# EAGLE design macse (EAGLE 9.6.1)
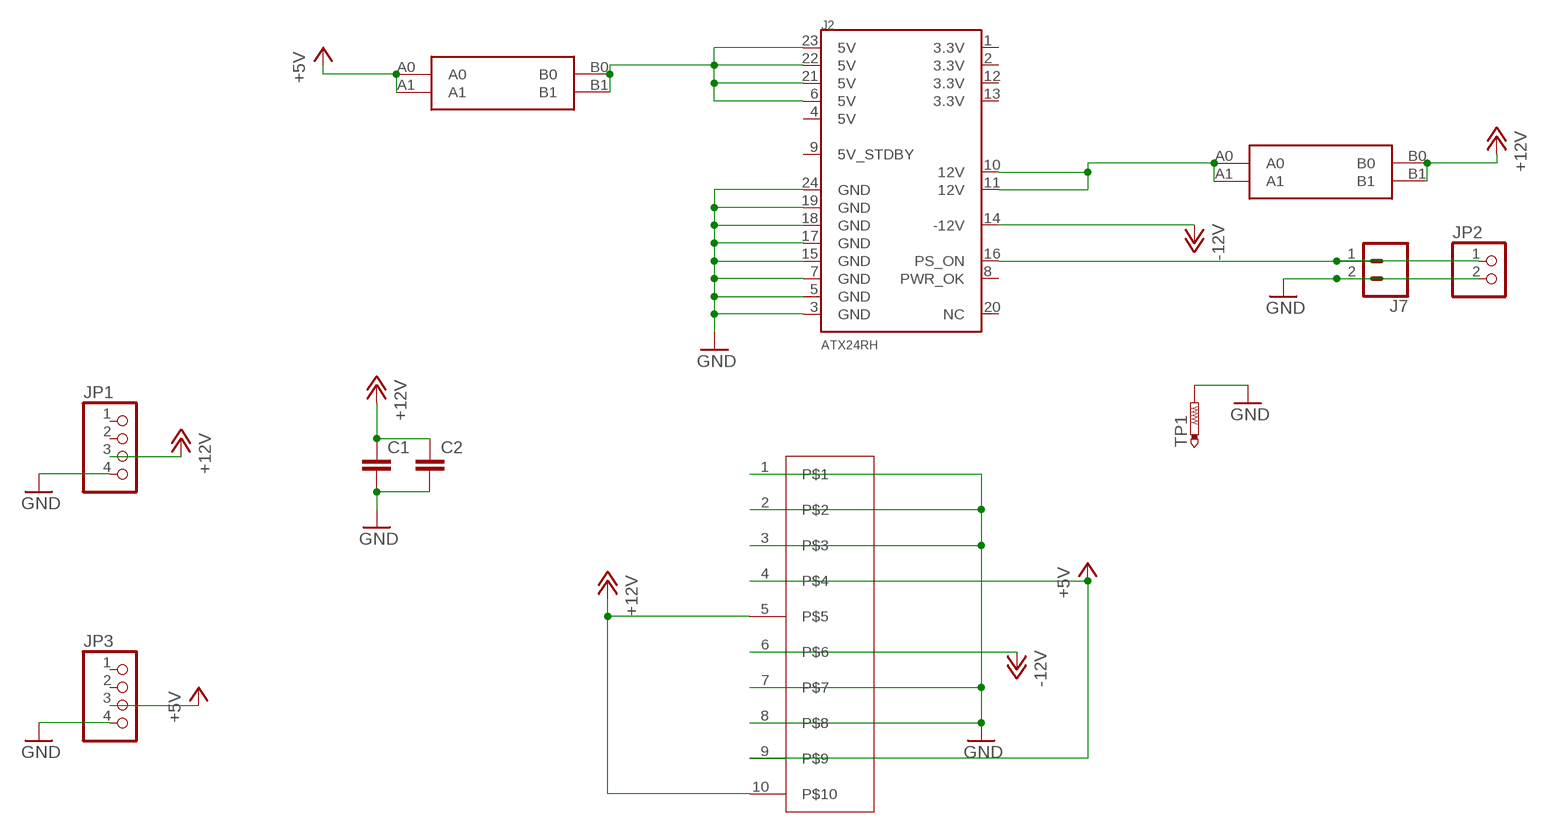
[diagram p0: schematic, sheet 1]

## Parts
C1  C5/2.5  [C5B2.5]
C2  C5/2.5  [C5B2.5]
J2  ATX24RH  [ATX24_RIGHT_ANGLE]
J7  CONN_023.5MM-NO_SILK  [SCREWTERMINAL-3.5MM-2-NS]
JP1  PINHD-1X4  [1X04]
JP2  PINHD-1X2  [1X02]
JP3  PINHD-1X4  [1X04]
TP1  PTR1PAD1-20Y  [P1-20Y]
U$1  MACSE  [MACSE_10P_STRAIGHT]
U$2  CAR_FUSE_HOLDER3IN1  [FUSE_HOLDER_3IN1]
U$8  CAR_FUSE_HOLDER3IN1  [FUSE_HOLDER_3IN1]

## Nets
+5V: JP3.3 U$1.4 U$1.9 U$8.A0 U$8.A1
+12V: C1.1 C2.1 JP1.3 U$1.5 U$1.10 U$2.B0 U$2.B1
-12V: J2.14(-12V) U$1.6
GND: C1.2 C2.2 J2.3(GND) J2.5(GND) J2.7(GND) J2.15(GND) J2.17(GND) J2.18(GND) J2.19(GND) J2.24(GND) J7.2 JP1.4 JP2.2 JP3.4 TP1.TP U$1.1 U$1.2 U$1.3 U$1.7 U$1.8
N$5: J2.16(PS_ON) J7.1 JP2.1
N$6: J2.6(5V) J2.21(5V) J2.22(5V) J2.23(5V) U$8.B0 U$8.B1
N$8: J2.10(12V) J2.11(12V) U$2.A0 U$2.A1
Unconnected: J2.1(3.3V) J2.2(3.3V) J2.4(5V) J2.8(PWR_OK) J2.9(5V_STDBY) J2.12(3.3V) J2.13(3.3V) J2.20(NC) JP1.1 JP1.2 JP3.1 JP3.2

## Library data of the parts
C1 C2 = capacitor-wima:C: CAPACITOR naming: grid - package width
J2 = macse:ATX24: ATX24 Pin Power Supply Connector This is a good connector for connecting a computer power supply to a PCB. It's massive, but provides many amps of power at 5V and 12V. SKU: PRT-09498
J7 = atx_power_control:CONN_02: Multi connection point. Often used as Generic Header-pin footprint for 0.1 inch spaced/style header connections On any of the 0.1 inch spaced packages, you can populate with these: Break Away Headers - Straight <https://www.sparkfun.com/products/116> (PRT-00116) Break Away Male Headers - Right Angle <https://www.sparkfun.com/products/553> (PRT-00553) Female Headers <https://www.sparkfun.com/products/115> (PRT-00115) Break Away Headers - Machine Pin <https://www.sparkfun.com/products/117> (PRT-00117) Break Away Female Headers - Swiss Machine Pin <https://www.sparkfun.com/products/743> (PRT-00743) For SCREWTERMINALS and SPRING TERMINALS visit here: Screw Terimnals on SparkFun.com <https://www.sparkfun.com/search/results?term=Screw+Terminals> (5mm/3.5mm/2.54mm spacing) This device is also useful as a general connection point to wire up your design to another part of your project. Our various solder wires solder well into these plated through hole pads. Hook-Up Wire - Assortment (Stranded, 22 AWG) <https://www.sparkfun.com/products/11375> (PRT-11375) Hook-Up Wire - Assortment (Solid Core, 22 AWG) <https://www.sparkfun.com/products/11367> (PRT-11367) View the entire wire category on our website here <https://www.sparkfun.com/categories/141> Special notes: Molex polarized connector foot print use with: PRT-08233 with associated crimp pins and housings. 2.54_SCREWTERM for use with PRT-10571. 3.5mm Screw Terminal footprints for PRT-08084 5mm Screw Terminal footprints for use with PRT-08432; PROD_ID: CONN-13512; SF_ID: PRT-09918; SF_SKU: PRT-08432; SKU: PRT-09914
JP1 JP3 = atx_power_control:PINHD-1X4: PIN HEADER
JP2 = pinhead:PINHD-1X2: PIN HEADER
TP1 = testpad:PTR1: TEST PIN
U$1 = atx4vc:MACSE
U$2 U$8 = atx_power_control:CAR_FUSE_HOLDER

## Board
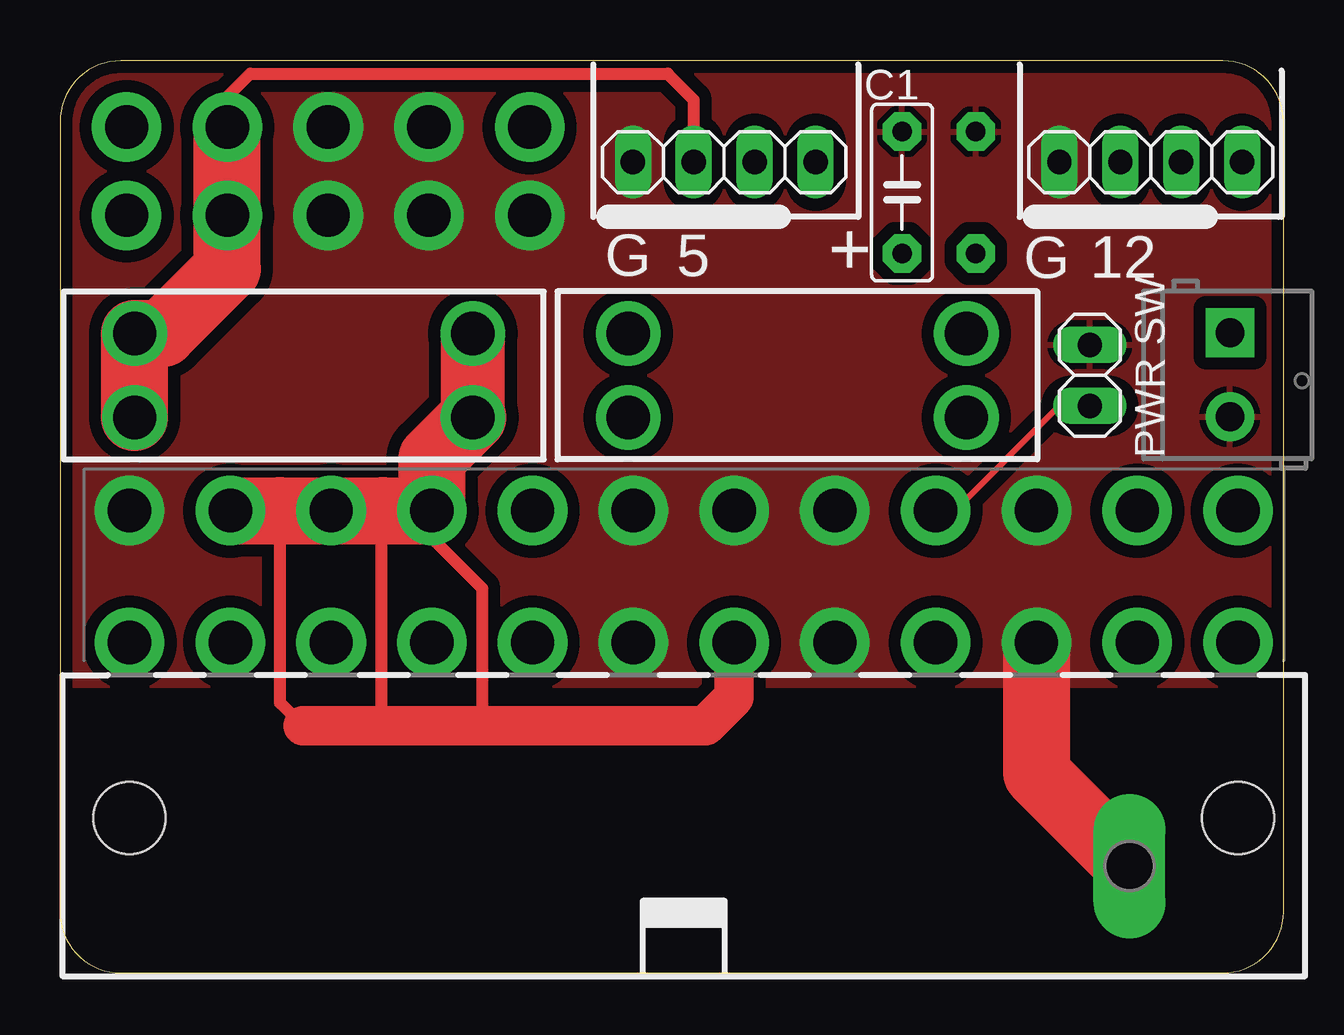
[diagram p1: board, top side]
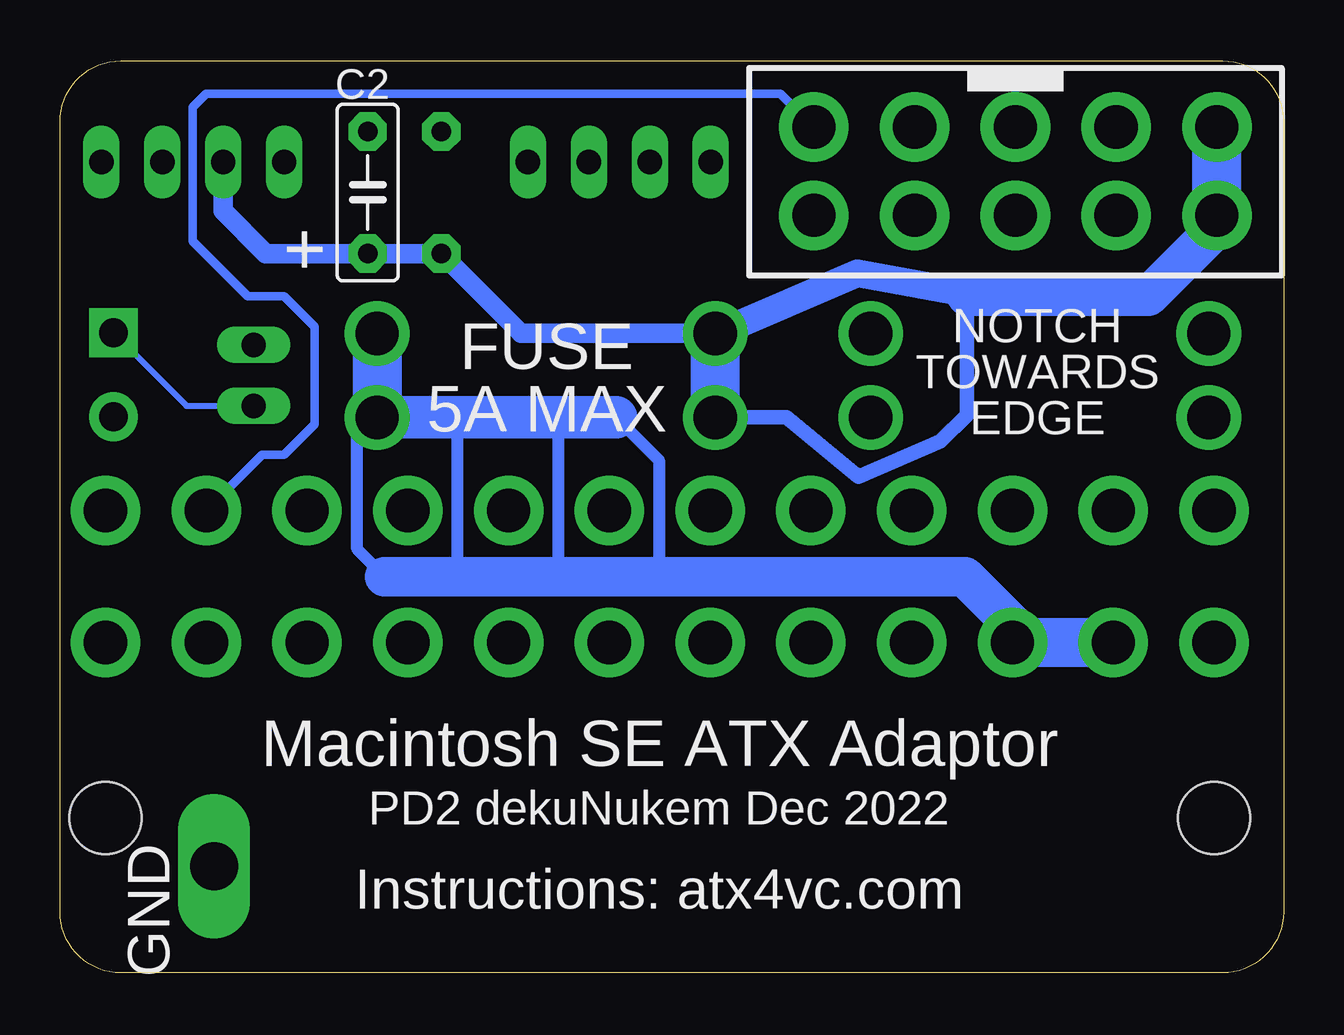
[diagram p2: board, bottom side, seen from below]

Size 51 x 38 mm. Coordinates in mm from the lower left corner, seen from the top.
Outline: 0,35.46 0,2.54 arc90 2.54,0 48.46,0 arc90 51,2.54 51,35.46 arc90 48.46,38 2.54,38 arc90 0,35.46
Copper layers (1*16): Top 0.035mm / dielectric 1.5mm / Bottom 0.035mm
Design rules "deku_2layer_6mil *": minimum track width 6mil, minimum drill 15mil, track to track 20mil, track to pad 6mil, pad to pad 6mil, via to via 6mil, smd to smd 6mil, copper to edge 10mil, drill to drill 6mil, minimum pad ring 7mil, minimum via ring 7mil, stop-mask expansion 4mil, vias tented up to drill 25mil, thermal gap 10mil

### Footprints (pad centres in the part's own frame; a part is rotated, then mirrored left to right if it is on the bottom)
C5B2.5 = drill 0.813 pad 1.6 octagon: 1 -2.54,0; 2 2.54,0
ATX24_RIGHT_ANGLE = drill 1.8 pad 2.9: 1 23.1,4.76; 2 18.9,4.76; 3 14.7,4.76; 4 10.5,4.76; 5 6.3,4.76; 6 2.1,4.76; 7 -2.1,4.76; 8 -6.3,4.76; 9 -10.5,4.76; 10 -14.7,4.76; 11 -18.9,4.76; 12 -23.1,4.76; 13 23.1,10.26; 14 18.9,10.26; 15 14.7,10.26; 16 10.5,10.26; 17 6.3,10.26; 18 2.1,10.26; 19 -2.1,10.26; 20 -6.3,10.26; 21 -10.5,10.26; 22 -14.7,10.26; 23 -18.9,10.26; 24 -23.1,10.26 | hole 3: -23.1,-2.54; 23.1,-2.54
SCREWTERMINAL-3.5MM-2-NS = drill 1.2 pad 2.032 square: 1 0,0 | drill 1.2 pad 2.032: 2 3.5,0
1X04 = drill 1.016 long: 1 -3.81,0; 2 -1.27,0; 3 1.27,0; 4 3.81,0
1X02 = drill 1.016 long: 1 -1.27,0; 2 1.27,0
P1-20Y = drill 2.007 pad 2.54 long: TP 0,0
MACSE_10P_STRAIGHT = drill 1.8 pad 2.9: 1 8.4,-1.84; 2 4.2,-1.84; 3 0,-1.84; 4 -4.2,-1.84; 5 -8.4,-1.84; 6 8.4,1.84; 7 4.2,1.84; 8 0,1.84; 9 -4.2,1.84; 10 -8.4,1.84
FUSE_HOLDER_3IN1 = drill 1.8: A0 -7.05,1.75; A1 -7.05,-1.75; B0 7.05,1.75; B1 7.05,-1.75

### Placement (x,y rotation side)
C1  35.1,32.51 90 top
C2  38.18,32.51 90 bottom
J2  26,9 0 top
J7  48.77,26.67 270 top
JP1  45.47,33.78 180 top
JP2  42.93,24.89 90 top
JP3  27.69,33.78 180 top
TP1  44.58,4.45 0 top
U$1  11.18,33.4 0 top
U$2  30.73,24.89 180 top
U$8  10.16,24.89 0 top

### Tracks (layer width: path | path; a pad name or v marks a point on that pad's centre or on a via)
+5V
  Top 0.508: U$1.9 6.98,36.51 7.93,37.47 25.32,37.47 26.42,36.37 JP3.3
  Top 2.794: U$8.A1 U$8.A0 4.29,26.64 6.98,29.33 U$1.4 U$1.9
+12V
  Bottom 0.61: U$2.B0 20.72,23.14 17.73,20.66 14.3,22.15 13.21,23.24 13.21,28.19
  Bottom 0.813: U$2.B1 31.77,26.64 C1.1 C2.1 42.42,29.97 44.2,31.75 JP1.3
  Bottom 1.143: U$2.B1 23.58,26.64 17.75,29.16 12.52,28.19
  Bottom 1.524: 2.78,31.05 U$1.5
  Bottom 1.651: 2.78,31.05 5.63,28.19 13.21,28.19
  Bottom 2.032: U$1.5 U$1.10 | U$2.B0 U$2.B1
-12V
  Bottom 0.356: J2.14 42.57,21.59 41.66,21.59 40.39,22.86 40.39,26.92 41.66,28.19 43.18,28.19 45.47,30.48 45.47,36.07 44.9,36.64 20.97,36.64 U$1.6
GND
  Top 2.794: J2.3 40.7,8.32 TP1.TP
  pour Top (isolate 0.508): 51,38 0,38 0,11.94 51,11.94
N$5
  Top 0.254: J2.16 37.29,19.26 41.66,23.62 JP2.1
  Bottom 0.254: J7.1 45.72,23.62 JP2.1
N$6
  Top 0.508: J2.21 15.5,18.12 17.6,16.02 17.6,10.29 | 13.46,19.26 13.39,19.26 13.39,10.29 | 10.13,10.29 9.17,11.25 9.17,19.26
  Top 1.651: J2.6 28.1,11.47 26.91,10.29 17.6,10.29 13.39,10.29 10.13,10.29
  Top 2.667: U$8.B1 U$8.B0
  Top 2.794: J2.23 9.17,19.26 J2.22 13.46,19.26 J2.21 15.5,21.43 U$8.B1
N$8
  Bottom 0.508: 37.47,16.51 38.61,17.65 38.61,22.32 U$2.A0 | 30.23,16.51 30.23,23.14 | 34.42,16.51 34.42,23.14 | 27.81,23.14 26.04,21.36 26.04,16.51
  Bottom 1.651: J2.10 11.3,14.52 13.29,16.51 26.04,16.51 30.23,16.51 34.42,16.51 37.47,16.51
  Bottom 1.778: U$2.A0 34.42,23.14 30.23,23.14 27.81,23.14
  Bottom 2.032: J2.11 J2.10 | U$2.A1 U$2.A0

### Text on the board
tNames: G | 5 | + | G | 12 | PWR SW
bNames: + | NOTCH / TOWARDS / EDGE | FUSE / 5A MAX | Macintosh SE ATX Adaptor | PD2 dekuNukem Dec 2022 | Instructions: atx4vc.com | GND